# EAGLE design WH-MDC05F3E5_comm_v3.0 (EAGLE 6.6.0)
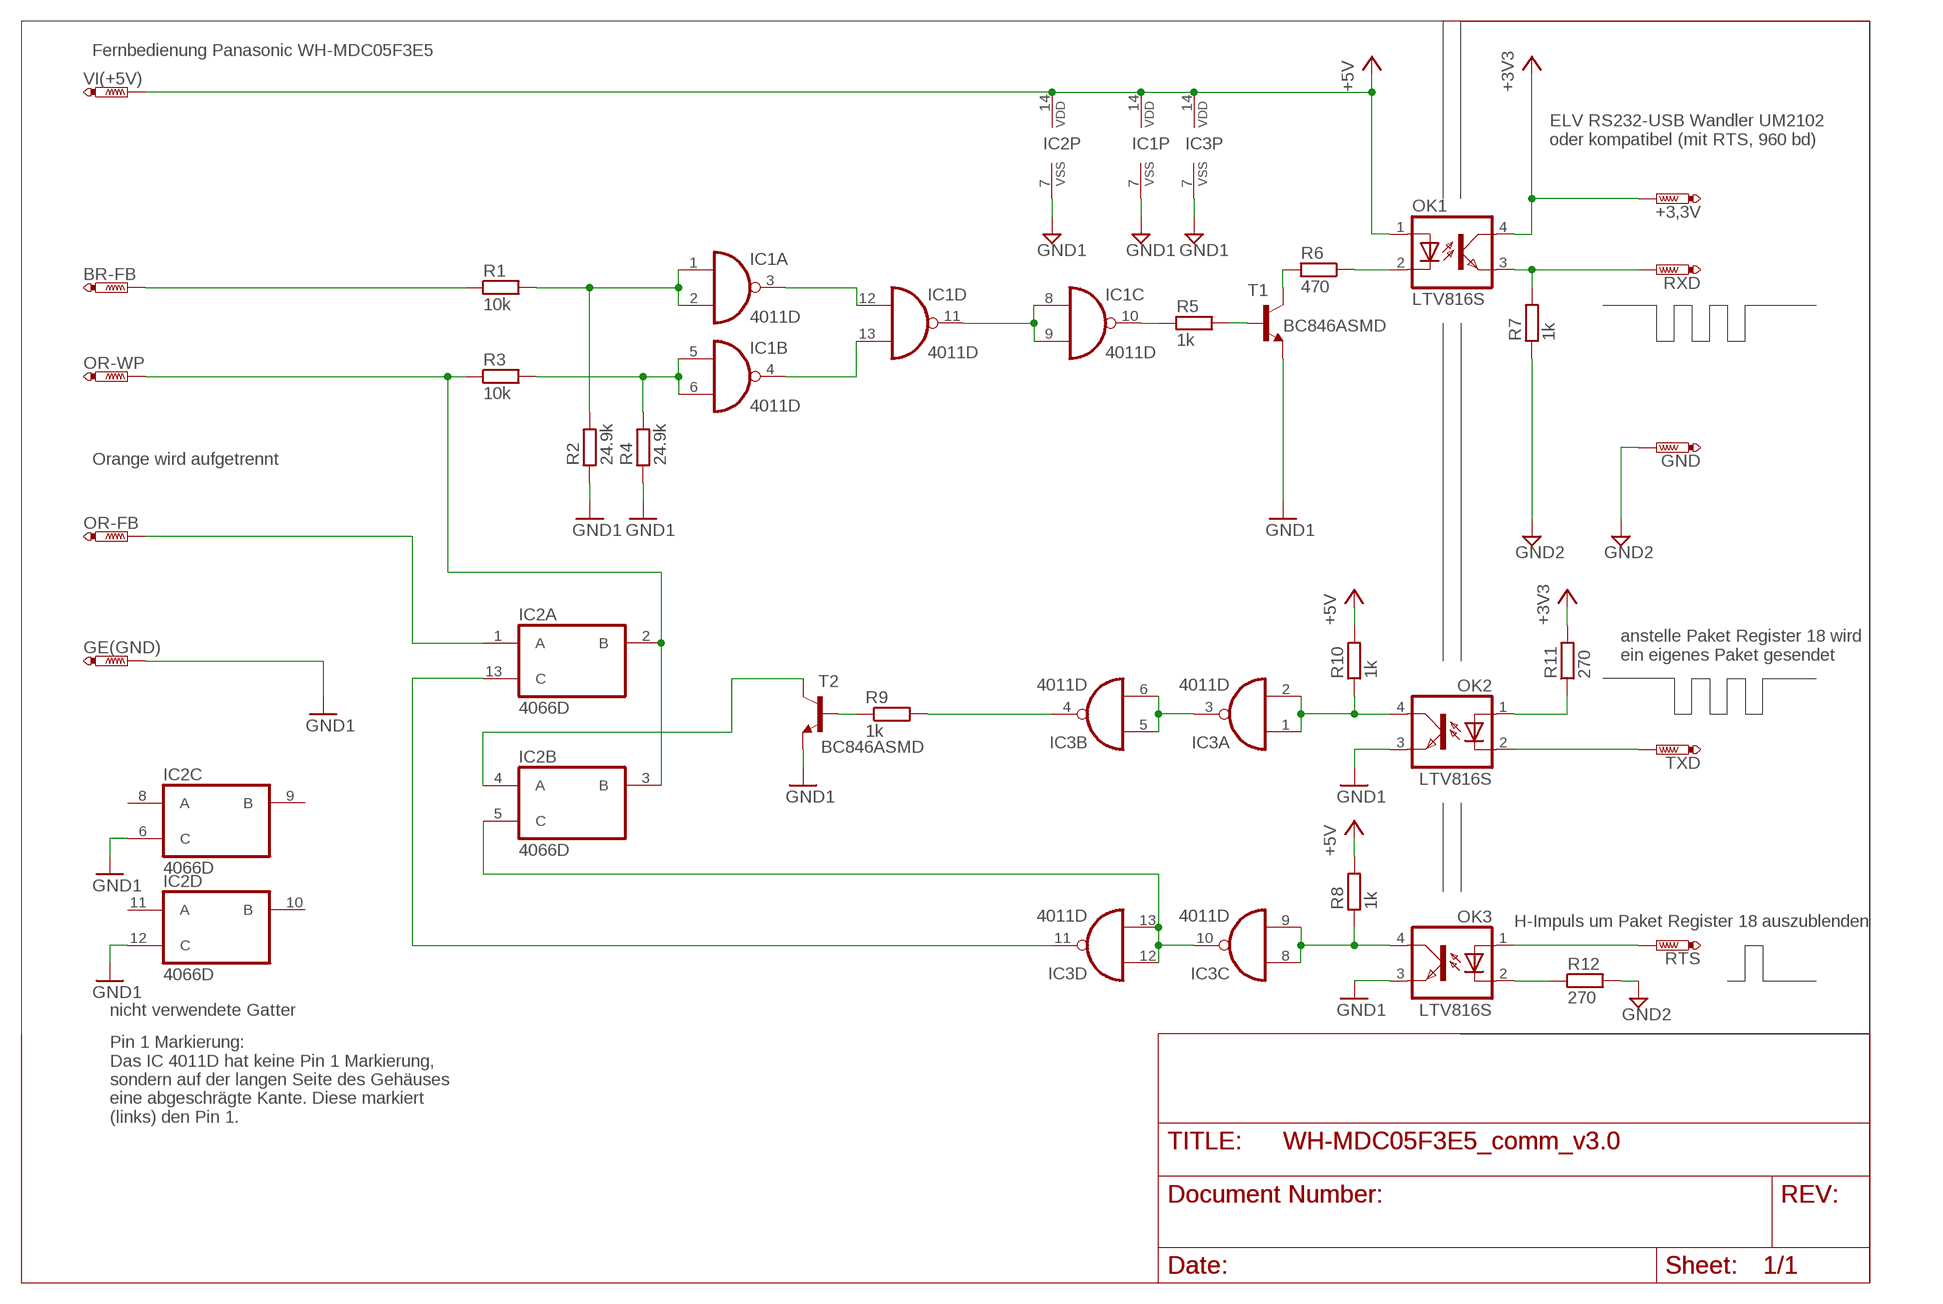
[diagram p0: schematic, sheet 1]

## Parts
+3,3V  PTR1PAD1-17  [P1-17]
BR-FB  PTR1PAD1-17  [P1-17]
GE(GND)  PTR1PAD1-17  [P1-17]
GND  PTR1PAD1-17  [P1-17]
IC1  4011D  [SO14]
IC2  4066D  [SO14]
IC3  4011D  [SO14]
OK1  LTV816S  [SMD4]
OK2  LTV816S  [SMD4]
OK3  LTV816S  [SMD4]
OR-FB  PTR1PAD1-17  [P1-17]
OR-WP  PTR1PAD1-17  [P1-17]
R1  10k  R-EU_R0805  [R0805]
R2  24.9k  R-EU_R0805  [R0805]
R3  10k  R-EU_R0805  [R0805]
R4  24.9k  R-EU_R0805  [R0805]
R5  1k  R-EU_R0805  [R0805]
R6  470  R-EU_R0805  [R0805]
R7  1k  R-EU_R0805  [R0805]
R8  1k  R-EU_R0805  [R0805]
R9  1k  R-EU_R0805  [R0805]
R10  1k  R-EU_R0805  [R0805]
R11  270  R-EU_R0805  [R0805]
R12  270  R-EU_R0805  [R0805]
RTS  PTR1PAD1-17  [P1-17]
RXD  PTR1PAD1-17  [P1-17]
T1  BC846ASMD  [SOT23]
T2  BC846ASMD  [SOT23]
TXD  PTR1PAD1-17  [P1-17]
VI(+5V)  PTR1PAD1-17  [P1-17]

## Nets
+3V3: +3,3V.TP OK1.4(COL) R11.2
+5V: IC1.14(P:VDD) IC2.14(P:VDD) IC3.14(P:VDD) OK1.1(A) R8.2 R10.2 VI(+5V).TP
GND1: GE(GND).TP IC1.7(P:VSS) IC2.6(C:C) IC2.7(P:VSS) IC2.12(D:C) IC3.7(P:VSS) OK2.3(EMIT) OK3.3(EMIT) R2.1 R4.1 T1.2(E) T2.2(E)
GND2: GND.TP R7.1 R12.2
N$1: IC1.1(A:I0) IC1.2(A:I1) R1.2 R2.2
N$2: IC1.5(B:I0) IC1.6(B:I1) R3.2 R4.2
N$3: IC1.3(A:O) IC1.12(D:I0)
N$4: IC1.4(B:O) IC1.13(D:I1)
N$5: IC1.8(C:I0) IC1.9(C:I1) IC1.11(D:O)
N$6: IC1.10(C:O) R5.1
N$7: R5.2 T1.1(B)
N$8: R6.2 T1.3(C)
N$9: OK1.2(C) R6.1
N$10: OK1.3(EMIT) R7.2 RXD.TP
N$11: IC2.4(B:A) T2.3(C)
N$12: OK2.1(A) R11.1
N$13: IC2.1(A:A) OR-FB.TP
N$14: IC2.2(A:B) IC2.3(B:B) OR-WP.TP R3.1
N$15: BR-FB.TP R1.1
N$16: OK2.2(C) TXD.TP
N$17: IC2.13(A:C) IC3.11(D:O)
N$18: IC3.8(C:I0) IC3.9(C:I1) OK3.4(COL) R8.1
N$19: IC2.5(B:C) IC3.10(C:O) IC3.12(D:I0) IC3.13(D:I1)
N$20: OK3.2(C) R12.1
N$21: OK3.1(A) RTS.TP
N$23: IC3.1(A:I0) IC3.2(A:I1) OK2.4(COL) R10.1
N$25: IC3.3(A:O) IC3.5(B:I0) IC3.6(B:I1)
N$26: R9.1 T2.1(B)
N$27: IC3.4(B:O) R9.2
Unconnected: IC2.8(C:A) IC2.9(C:B) IC2.10(D:B) IC2.11(D:A)

## Notes on the sheet
- Fernbedienung Panasonic WH-MDC05F3E5
- ELV RS232-USB Wandler UM2102
  oder kompatibel (mit RTS, 960 bd)
- Orange wird aufgetrennt
- anstelle Paket Register 18 wird
  ein eigenes Paket gesendet
- H-Impuls um Paket Register 18 auszublenden
- nicht verwendete Gatter
- Pin 1 Markierung:
  Das IC 4011D hat keine Pin 1 Markierung, 
  sondern auf der langen Seite des Gehäuses 
  eine abgeschrägte Kante. Diese markiert
  (links) den Pin 1.

## Library data of the parts
+3,3V BR-FB GE(GND) GND OR-FB OR-WP RTS RXD TXD VI(+5V) = testpad:PTR1: TEST PIN
IC1 IC3 = 40xx:4011: Quad 2-input NAND
IC2 = 40xx:4066: Quad bilateral ANALOG SWITCH
OK1-OK3 = optocoupler:LTV816: OPTO COUPLER Source: LITEON, LTV816.pdf; OC_FARNELL: unknown; OC_NEWARK: unknown
R1-R12 = resistor:R-EU_: RESISTOR, European symbol
T1 T2 = transistor-npn:BC846*: NPN Transistor

## Board
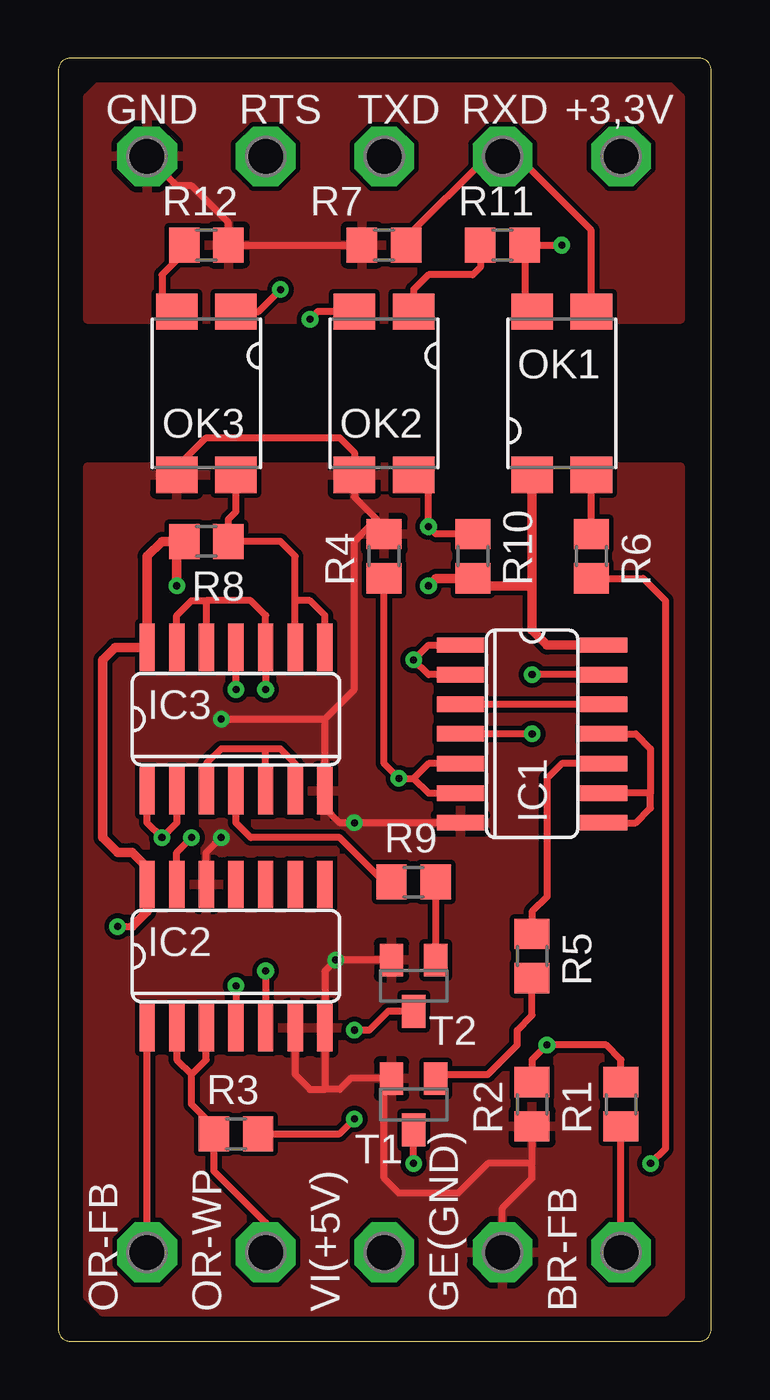
[diagram p1: board, top side]
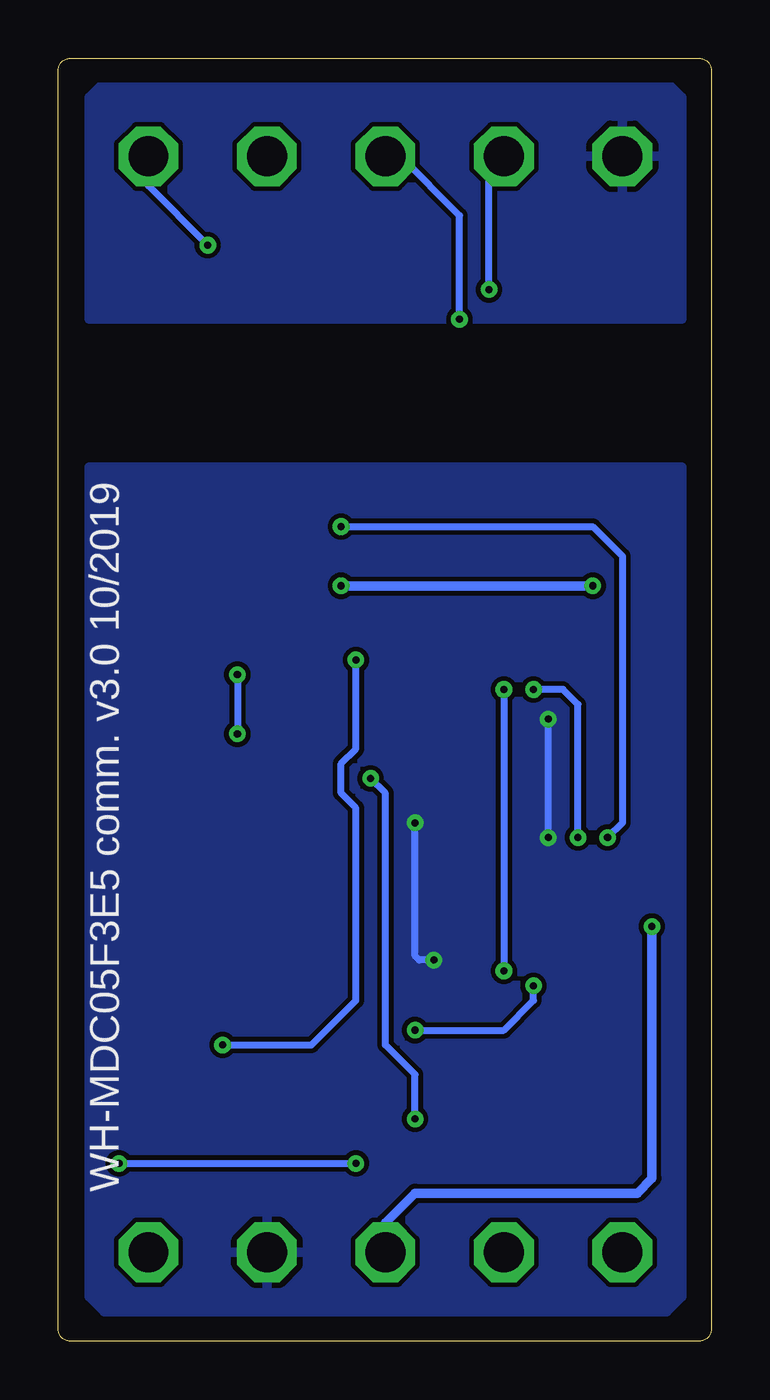
[diagram p2: board, bottom side, seen from below]

Size 28 x 55 mm. Coordinates in mm from the lower left corner, seen from the top.
Outline: 0,54.5 0,0.5 arc90 0.5,0 27.5,0 arc90 28,0.5 28,54.5 arc90 27.5,55 0.5,55 arc90 0,54.5
Copper layers (1*16): Top 0.035mm / dielectric 1.5mm / Bottom 0.035mm
Design rules "default": minimum track width 10mil, minimum drill 24mil, track to track 8mil, track to pad 8mil, pad to pad 8mil, via to via 8mil, smd to smd 8mil, copper to edge 40mil, drill to drill 8mil, minimum pad ring 10mil, minimum via ring 8mil, stop-mask expansion 4mil, vias tented up to drill 0mil, thermal gap 10mil

### Footprints (pad centres in the part's own frame; a part is rotated, then mirrored left to right if it is on the bottom)
P1-17 = drill 1.702 pad 2.54 octagon: TP 0,0
SO14 = smd 0.66 x 2.032: 1 -3.81,-3.073; 2 -2.54,-3.073; 3 -1.27,-3.073; 4 0,-3.073; 5 1.27,-3.073; 6 2.54,-3.073; 7 3.81,-3.073; 8 3.81,3.073; 9 2.54,3.073; 10 1.27,3.073; 11 0,3.073; 12 -1.27,3.073; 13 -2.54,3.073; 14 -3.81,3.073
SMD4 = smd 1.78 x 1.55: 1 -1.27,-3.5; 2 1.27,-3.5; 3 1.27,3.5; 4 -1.27,3.5
R0805 = smd 1.3 x 1.5: 1 -0.95,0; 2 0.95,0
SOT23 = smd 1 x 1.4: 1 -0.95,-1.1; 2 0.95,-1.1; 3 0,1.1

### Placement (x,y rotation side)
+3,3V  24.13,50.8 0 top
BR-FB  24.13,3.81 0 top
GE(GND)  19.05,3.81 0 top
GND  3.81,50.8 0 top
IC1  20.32,26.04 270 top
IC2  7.62,16.51 0 top
IC3  7.62,26.67 0 top
OK1  21.59,40.64 0 top
OK2  13.97,40.64 180 top
OK3  6.35,40.64 180 top
OR-FB  3.81,3.81 0 top
OR-WP  8.89,3.81 0 top
R1  24.13,10.16 90 top
R2  20.32,10.16 90 top
R3  7.62,8.89 0 top
R4  13.97,33.66 270 top
R5  20.32,16.51 270 top
R6  22.86,33.66 270 top
R7  13.97,46.99 0 top
R8  6.35,34.29 180 top
R9  15.24,19.68 180 top
R10  17.78,33.66 270 top
R11  19.05,46.99 0 top
R12  6.35,46.99 0 top
RTS  8.89,50.8 0 top
RXD  19.05,50.8 0 top
T1  15.24,10.16 180 top
T2  15.24,15.24 180 top
TXD  13.97,50.8 0 top
VI(+5V)  13.97,3.81 0 top

### Tracks (layer width: path | path; a pad name or v marks a point on that pad's centre or on a via)
+3V3  (via drill 0.3)
  Top 0.305: OK1.4 20,44.46 R11.2 v21.59,46.99
  Bottom 0.305: v21.59,46.99 24.13,49.53 +3,3V.TP
+5V  (via drill 0.3)
  Top 0.305: 3.81,20.32 IC2.14 | v2.54,17.78 3.17,17.78 | 5.08,33.66 5.4,33.98 5.71,33.98 R8.2
  Top 0.406: 3.81,20.32 3.17,20.95 2.54,20.95 1.91,21.59 1.91,29.21 2.44,29.74 IC3.14 3.81,33.66 4.45,34.29 R8.2 | OK1.1 20.32,32.38 | 20.32,32.38 20.32,30.48 20.95,29.84 IC1.14 | 20.32,32.38 18.1,32.38 R10.2 16.2,32.7 v15.88,32.38 | 3.17,17.78 3.81,18.41 IC2.14 | v5.08,32.38 5.08,33.66
  Bottom 0.406: VI(+5V).TP 13.97,5.08 12.7,6.35 3.17,6.35 2.54,6.99 v2.54,17.78 | v15.88,32.38 v5.08,32.38
GND1  (via drill 0.3)
  Top 0.305: 11.43,10.79 IC2.7 11.43,15.88 v11.89,16.34 T2.2 | IC2.6 10.16,11.43 10.79,10.79 11.43,10.79 | GE(GND).TP 19.05,5.71 20.32,6.99 20.32,7.62 | 11.43,10.79 12.06,10.79 12.53,11.26 T1.2 13.97,10.94 13.97,6.99 14.61,6.35 17.14,6.35 18.41,7.62 20.32,7.62 | R2.1 20.32,7.62 | IC1.7 v12.7,22.23 12.06,22.23 11.43,22.86 IC3.7 11.43,26.67 | OK3.3 5.08,37.47 6.35,38.73 12.06,38.73 12.7,38.1 OK2.3 12.7,36.2 13.97,34.92 R4.1 13.65,34.92 13.34,34.92 12.7,34.29 12.7,27.94 11.43,26.67 | IC2.12 6.35,20.95 v6.99,21.59 | v6.99,26.67 11.43,26.67
  Bottom 0.305: v6.99,21.59 v6.99,26.67 | v11.89,16.34 12.53,16.34 12.7,16.51 v12.7,22.23
  pour Bottom: 1.27,37.47 1.27,1.91 1.91,1.27 26.04,1.27 26.67,1.91 26.67,37.47
  pour Top: 1.27,37.47 26.67,37.47 26.67,1.91 26.04,1.27 1.91,1.27 1.27,1.91
GND2
  Top 0.305: GND.TP 5.08,49.53 5.71,49.53 7.3,47.95 R12.2 R7.1
  pour Top: 1.91,53.98 1.27,53.34 1.27,43.81 26.67,43.81 26.67,53.34 26.04,53.98
  pour Bottom: 1.91,53.98 26.04,53.98 26.67,53.34 26.67,43.81 1.27,43.81 1.27,53.34
N$1  (via drill 0.3)
  Top 0.305: R1.2 24.13,12.06 23.5,12.7 v20.95,12.7 20.32,12.06 R2.2 | IC1.2 15.88,28.57 v15.24,29.21 15.88,29.84 IC1.1
  Bottom 0.305: v20.95,12.7 17.14,12.7 15.24,14.61 15.24,22.86 15.88,23.5 15.88,24.77 15.24,25.4 v15.24,29.21
N$2  (via drill 0.3)
  Top 0.305: IC1.5 15.88,24.77 15.24,24.13 | 15.24,24.13 15.88,23.5 IC1.6 | R4.2 13.97,24.77 v14.61,24.13 15.24,24.13 | R3.2 12.06,8.89 v12.7,9.53
  Bottom 0.305: v12.7,9.53 12.7,11.43 13.97,12.7 13.97,23.5 v14.61,24.13
N$3
  Top 0.305: IC1.12 IC1.3
N$4  (via drill 0.3)
  Top 0.305: IC1.13 v20.32,28.57 | v20.32,26.04 IC1.4
  Bottom 0.305: v20.32,28.57 v20.32,26.04
N$5
  Top 0.305: IC1.11 24.77,26.04 25.4,25.4 25.4,23.5 | 25.4,23.5 IC1.9 | IC1.8 24.77,22.23 25.4,22.86 25.4,23.5
N$6
  Top 0.305: IC1.10 21.59,24.77 20.95,24.13 20.95,19.05 20.32,18.41 R5.1
N$7
  Top 0.305: T1.1 16.36,11.43 18.41,11.43 19.68,12.7 19.68,13.34 20.32,13.97 R5.2
N$8  (via drill 0.3)
  Top 0.305: R6.2 25.08,32.7 26.04,31.75 26.04,8.26 v25.4,7.62 | v15.24,7.62 T1.3
  Bottom 0.305: v25.4,7.62 v15.24,7.62
N$9
  Top 0.305: R6.1 OK1.2
N$10
  Top 0.305: R7.2 14.92,47.3 18.41,50.8 RXD.TP 19.68,50.8 22.86,47.62 OK1.3
N$11  (via drill 0.3)
  Top 0.305: T2.3 14.14,14.14 13.34,13.34 v12.7,13.34 | v7.62,15.24 IC2.4
  Bottom 0.305: v12.7,13.34 8.89,13.34 7.62,14.61 v7.62,15.24
N$12
  Top 0.305: R11.1 18.1,46.04 17.78,45.72 15.88,45.72 15.24,45.09 OK2.1
N$13
  Top 0.305: OR-FB.TP IC2.1
N$14
  Top 0.305: IC2.2 5.08,12.06 5.71,11.43 | 5.71,11.43 6.35,12.06 IC2.3 | 5.71,11.43 5.71,10.16 6.67,9.21 R3.1 6.67,7.3 8.89,5.08 OR-WP.TP
N$15
  Top 0.305: BR-FB.TP R1.1
N$16  (via drill 0.3)
  Top 0.305: OK2.2 11.12,44.14 v10.79,43.81
  Bottom 0.305: v10.79,43.81 10.79,48.26 13.34,50.8 TXD.TP
N$17  (via drill 0.3)
  Top 0.305: IC2.13 5.08,20.95 v5.71,21.59 | v7.62,27.94 IC3.11
  Bottom 0.305: v5.71,21.59 5.71,27.3 6.35,27.94 v7.62,27.94
N$18
  Top 0.305: IC3.9 10.16,31.75 | 10.16,31.75 10.16,33.66 9.53,34.29 R8.1 7.3,35.24 7.62,35.56 OK3.4 | IC3.8 11.43,31.11 10.79,31.75 10.16,31.75
N$19  (via drill 0.3)
  Top 0.305: IC3.13 5.08,31.11 5.71,31.75 6.35,31.75 | 6.35,31.75 IC3.12 | 6.35,31.75 8.26,31.75 8.89,31.11 IC3.10 v8.89,27.94 | v8.89,15.88 IC2.5
  Bottom 0.305: v8.89,27.94 v8.89,15.88
N$20
  Top 0.305: R12.1 5.4,46.67 4.45,45.72 4.45,44.77 OK3.2
N$21  (via drill 0.3)
  Top 0.305: OK3.1 8.58,44.14 v9.53,45.09
  Bottom 0.305: v9.53,45.09 9.53,50.16 RTS.TP
N$23  (via drill 0.3)
  Top 0.305: R10.1 16.2,34.6 v15.88,34.92 15.88,36.51 OK2.4 | IC3.2 5.08,22.23 v4.45,21.59 3.81,22.23 IC3.1
  Bottom 0.305: v15.88,34.92 5.08,34.92 3.81,33.66 3.81,22.23 v4.45,21.59
N$25
  Top 0.305: IC3.6 10.16,24.77 9.53,25.4 8.89,25.4 | 8.89,25.4 6.99,25.4 6.35,24.77 IC3.3 6.35,23.5 | IC3.5 8.89,25.4
N$26
  Top 0.305: T2.1 R9.1
N$27
  Top 0.305: R9.2 13.97,19.68 12.06,21.59 8.26,21.59 7.62,22.23 IC3.4

### Text on the board
bPlace: WH-MDC05F3E5 comm. v3.0 10/2019